# EasyEDA schematic SCH_EasyEDA_OpenComs_ABP1_Front-panel_2023-05-12.json
TITLE: PCB_OpenComs_ABP1_Front panel; REV: 1.0; Date: 2023-04-20; Sheet: 1/1; Drawn By: TheStaticTurtle; Company: OpenComs
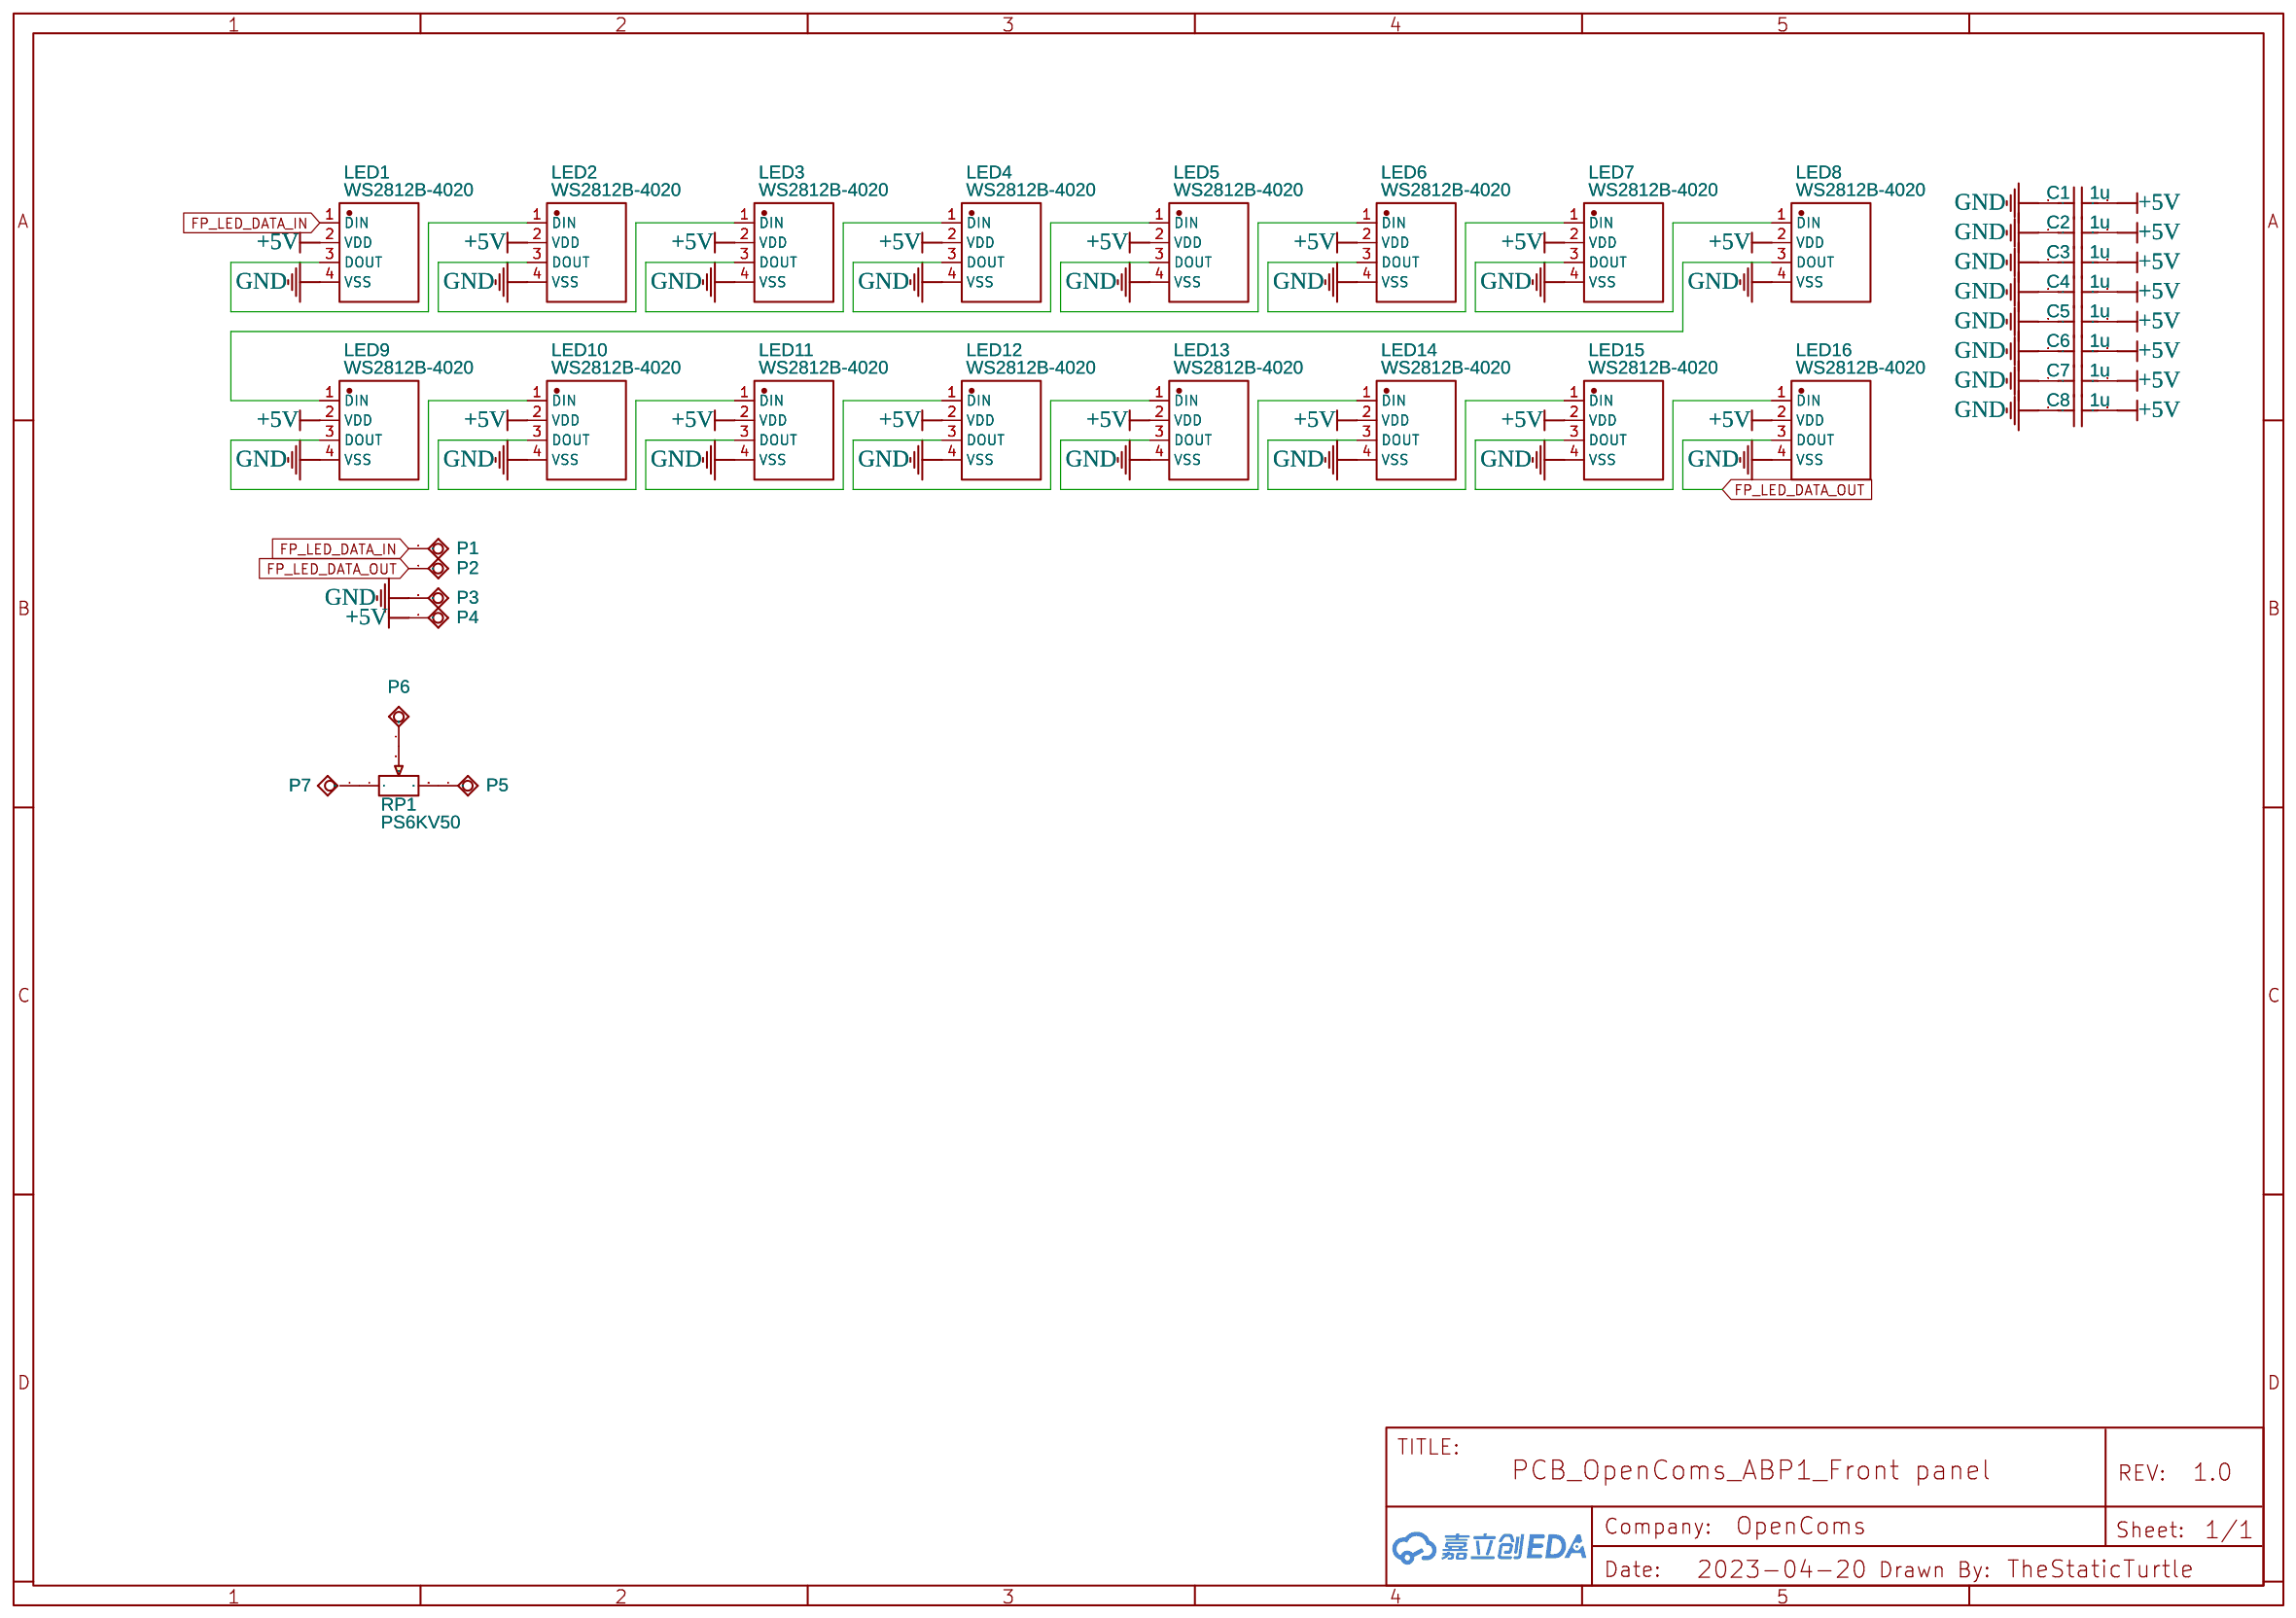
[diagram p0: schematic sheet]

## Parts
C1  1u  [C0805]
C2  1u  [C0805]
C3  1u  [C0805]
C4  1u  [C0805]
C5  1u  [C0805]
C6  1u  [C0805]
C7  1u  [C0805]
C8  1u  [C0805]
LED1  WS2812B-4020  [LED-SMD_WS2812B-4020]
LED2  WS2812B-4020  [LED-SMD_WS2812B-4020]
LED3  WS2812B-4020  [LED-SMD_WS2812B-4020]
LED4  WS2812B-4020  [LED-SMD_WS2812B-4020]
LED5  WS2812B-4020  [LED-SMD_WS2812B-4020]
LED6  WS2812B-4020  [LED-SMD_WS2812B-4020]
LED7  WS2812B-4020  [LED-SMD_WS2812B-4020]
LED8  WS2812B-4020  [LED-SMD_WS2812B-4020]
LED9  WS2812B-4020  [LED-SMD_WS2812B-4020]
LED10  WS2812B-4020  [LED-SMD_WS2812B-4020]
LED11  WS2812B-4020  [LED-SMD_WS2812B-4020]
LED12  WS2812B-4020  [LED-SMD_WS2812B-4020]
LED13  WS2812B-4020  [LED-SMD_WS2812B-4020]
LED14  WS2812B-4020  [LED-SMD_WS2812B-4020]
LED15  WS2812B-4020  [LED-SMD_WS2812B-4020]
LED16  WS2812B-4020  [LED-SMD_WS2812B-4020]
P1  TESTPAD50  [TESTPAD-50-ROUND]
P2  TESTPAD50  [TESTPAD-50-ROUND]
P3  TESTPAD50  [TESTPAD-50-ROUND]
P4  TESTPAD50  [TESTPAD-50-ROUND]
P5  TESTPAD50  [TESTPAD-50-ROUND]
P6  TESTPAD50  [TESTPAD-50-ROUND]
P7  TESTPAD50  [TESTPAD-50-ROUND]
RP1  PS6KV50  [PS6_POTMETER]

## Library data of the parts
C1-C8 = C_0805_US: Supplier Part: C28323; Supplier: LCSC; Contributor: LCEDA_Lib; Manufacturer Part: CL21B105KBFNNNE; Manufacturer: SAMSUNG(三星)
LED1-LED16 = WS2812B-4020: Supplier: LCSC; Supplier Part: C965557; Manufacturer: worldsemi; Contributor: LCSC; JLCPCB Part Class: Extended Part
P1-P7 = TESTPAD50: Contributor: radiofm
RP1 = PS6KV50: Manufacturer: PIHER; Manufacturer Part: PS6KV50-103A3030-I-PM; Supplier: TME; Supplier Part: PS6KV50-103A-I-PM; link: https://www.piher.net/sensors/index.php/component/virtuemart/?page=shop.product_details&flypage=flypage.tpl&product_id=40&category_id=2; Contributor: ViperPiz

## Nets
+5V: C1.2 C2.2 C3.2 C4.2 C5.2 C6.2 C7.2 C8.2 LED1.2(VDD) LED2.2(VDD) LED3.2(VDD) LED4.2(VDD) LED5.2(VDD) LED6.2(VDD) LED7.2(VDD) LED8.2(VDD) LED9.2(VDD) LED10.2(VDD) LED11.2(VDD) LED12.2(VDD) LED13.2(VDD) LED14.2(VDD) LED15.2(VDD) LED16.2(VDD) P4.1(PP)
GND: C1.1 C2.1 C3.1 C4.1 C5.1 C6.1 C7.1 C8.1 LED1.4(VSS) LED2.4(VSS) LED3.4(VSS) LED4.4(VSS) LED5.4(VSS) LED6.4(VSS) LED7.4(VSS) LED8.4(VSS) LED9.4(VSS) LED10.4(VSS) LED11.4(VSS) LED12.4(VSS) LED13.4(VSS) LED14.4(VSS) LED15.4(VSS) LED16.4(VSS) P3.1(PP)
FP_LED_DATA_IN: LED1.1(DIN) P1.1(PP)
FP_LED_DATA_OUT: LED16.3(DOUT) P2.1(PP)
Net-(LED1-3): LED1.3(DOUT) LED2.1(DIN)
Net-(LED2-3): LED2.3(DOUT) LED3.1(DIN)
Net-(LED3-3): LED3.3(DOUT) LED4.1(DIN)
Net-(LED4-3): LED4.3(DOUT) LED5.1(DIN)
Net-(LED5-3): LED5.3(DOUT) LED6.1(DIN)
Net-(LED6-3): LED6.3(DOUT) LED7.1(DIN)
Net-(LED7-3): LED7.3(DOUT) LED8.1(DIN)
Net-(LED8-3): LED8.3(DOUT) LED9.1(DIN)
Net-(LED9-3): LED9.3(DOUT) LED10.1(DIN)
Net-(LED10-3): LED10.3(DOUT) LED11.1(DIN)
Net-(LED11-3): LED11.3(DOUT) LED12.1(DIN)
Net-(LED12-3): LED12.3(DOUT) LED13.1(DIN)
Net-(LED13-3): LED13.3(DOUT) LED14.1(DIN)
Net-(LED14-3): LED14.3(DOUT) LED15.1(DIN)
Net-(LED15-3): LED15.3(DOUT) LED16.1(DIN)
Net-(P5-1): P5.1(PP) RP1.3
Net-(P6-1): P6.1(PP) RP1.2
Net-(P7-1): P7.1(PP) RP1.1
